# EAGLE schematic RCfilter for MSGEQ7 (EAGLE 7.2.0)
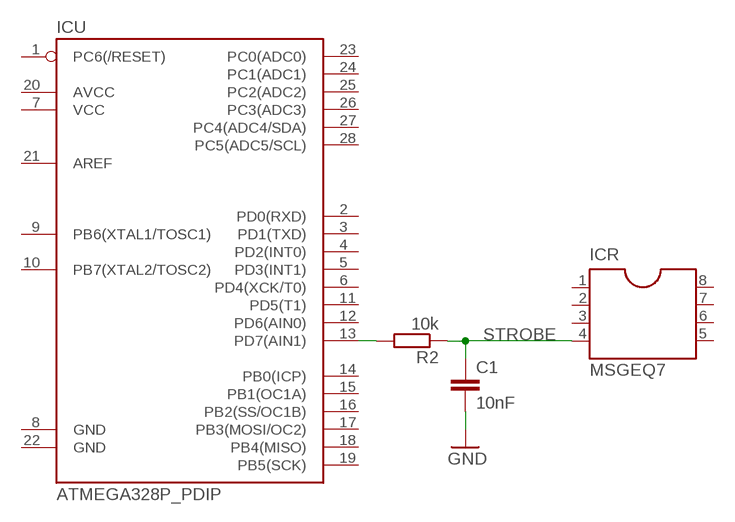
[diagram p0: schematic, sheet 1]

## Parts
C1  10nF  C-EU025-025X050  [C025-025X050]
ICR  MSGEQ7  DIL08  [DIL08]
ICU  ATMEGA328P_PDIP  [DIL28-3]
R2  10k  R-EU_0207/12  [0207/12]

## Nets
GND: C1.2
N$1: ICU.13(PD7(AIN1)) R2.2
STROBE: C1.1 ICR.4 R2.1
Unconnected: ICR.1 ICR.2 ICR.3 ICR.5 ICR.6 ICR.7 ICR.8 ICU.1(PC6(/RESET)) ICU.2(PD0(RXD)) ICU.3(PD1(TXD)) ICU.4(PD2(INT0)) ICU.5(PD3(INT1)) ICU.6(PD4(XCK/T0)) ICU.7(VCC) ICU.8(GND) ICU.9(PB6(XTAL1/TOSC1)) ICU.10(PB7(XTAL2/TOSC2)) ICU.11(PD5(T1)) ICU.12(PD6(AIN0)) ICU.14(PB0(ICP)) ICU.15(PB1(OC1A)) ICU.16(PB2(SS/OC1B)) ICU.17(PB3(MOSI/OC2)) ICU.18(PB4(MISO)) ICU.19(PB5(SCK)) ICU.20(AVCC) ICU.21(AREF) ICU.22(GND) ICU.23(PC0(ADC0)) ICU.24(PC1(ADC1)) ICU.25(PC2(ADC2)) ICU.26(PC3(ADC3)) ICU.27(PC4(ADC4/SDA)) ICU.28(PC5(ADC5/SCL))

## Library data of the parts
C1 = rcl:C-EU: CAPACITOR, European symbol
ICR = cvdo-dil-packages:DIL08
ICU = SparkFun-DigitalIC:ATMEGA328P_PDIP: uC used in the Arduino 32kb flash, 1k EEPROM, 2k SRAM This is the through-hole version of this chip.
R2 = rcl:R-EU_: RESISTOR, European symbol